# EAGLE design Schematic_RO (EAGLE 9.6.2)
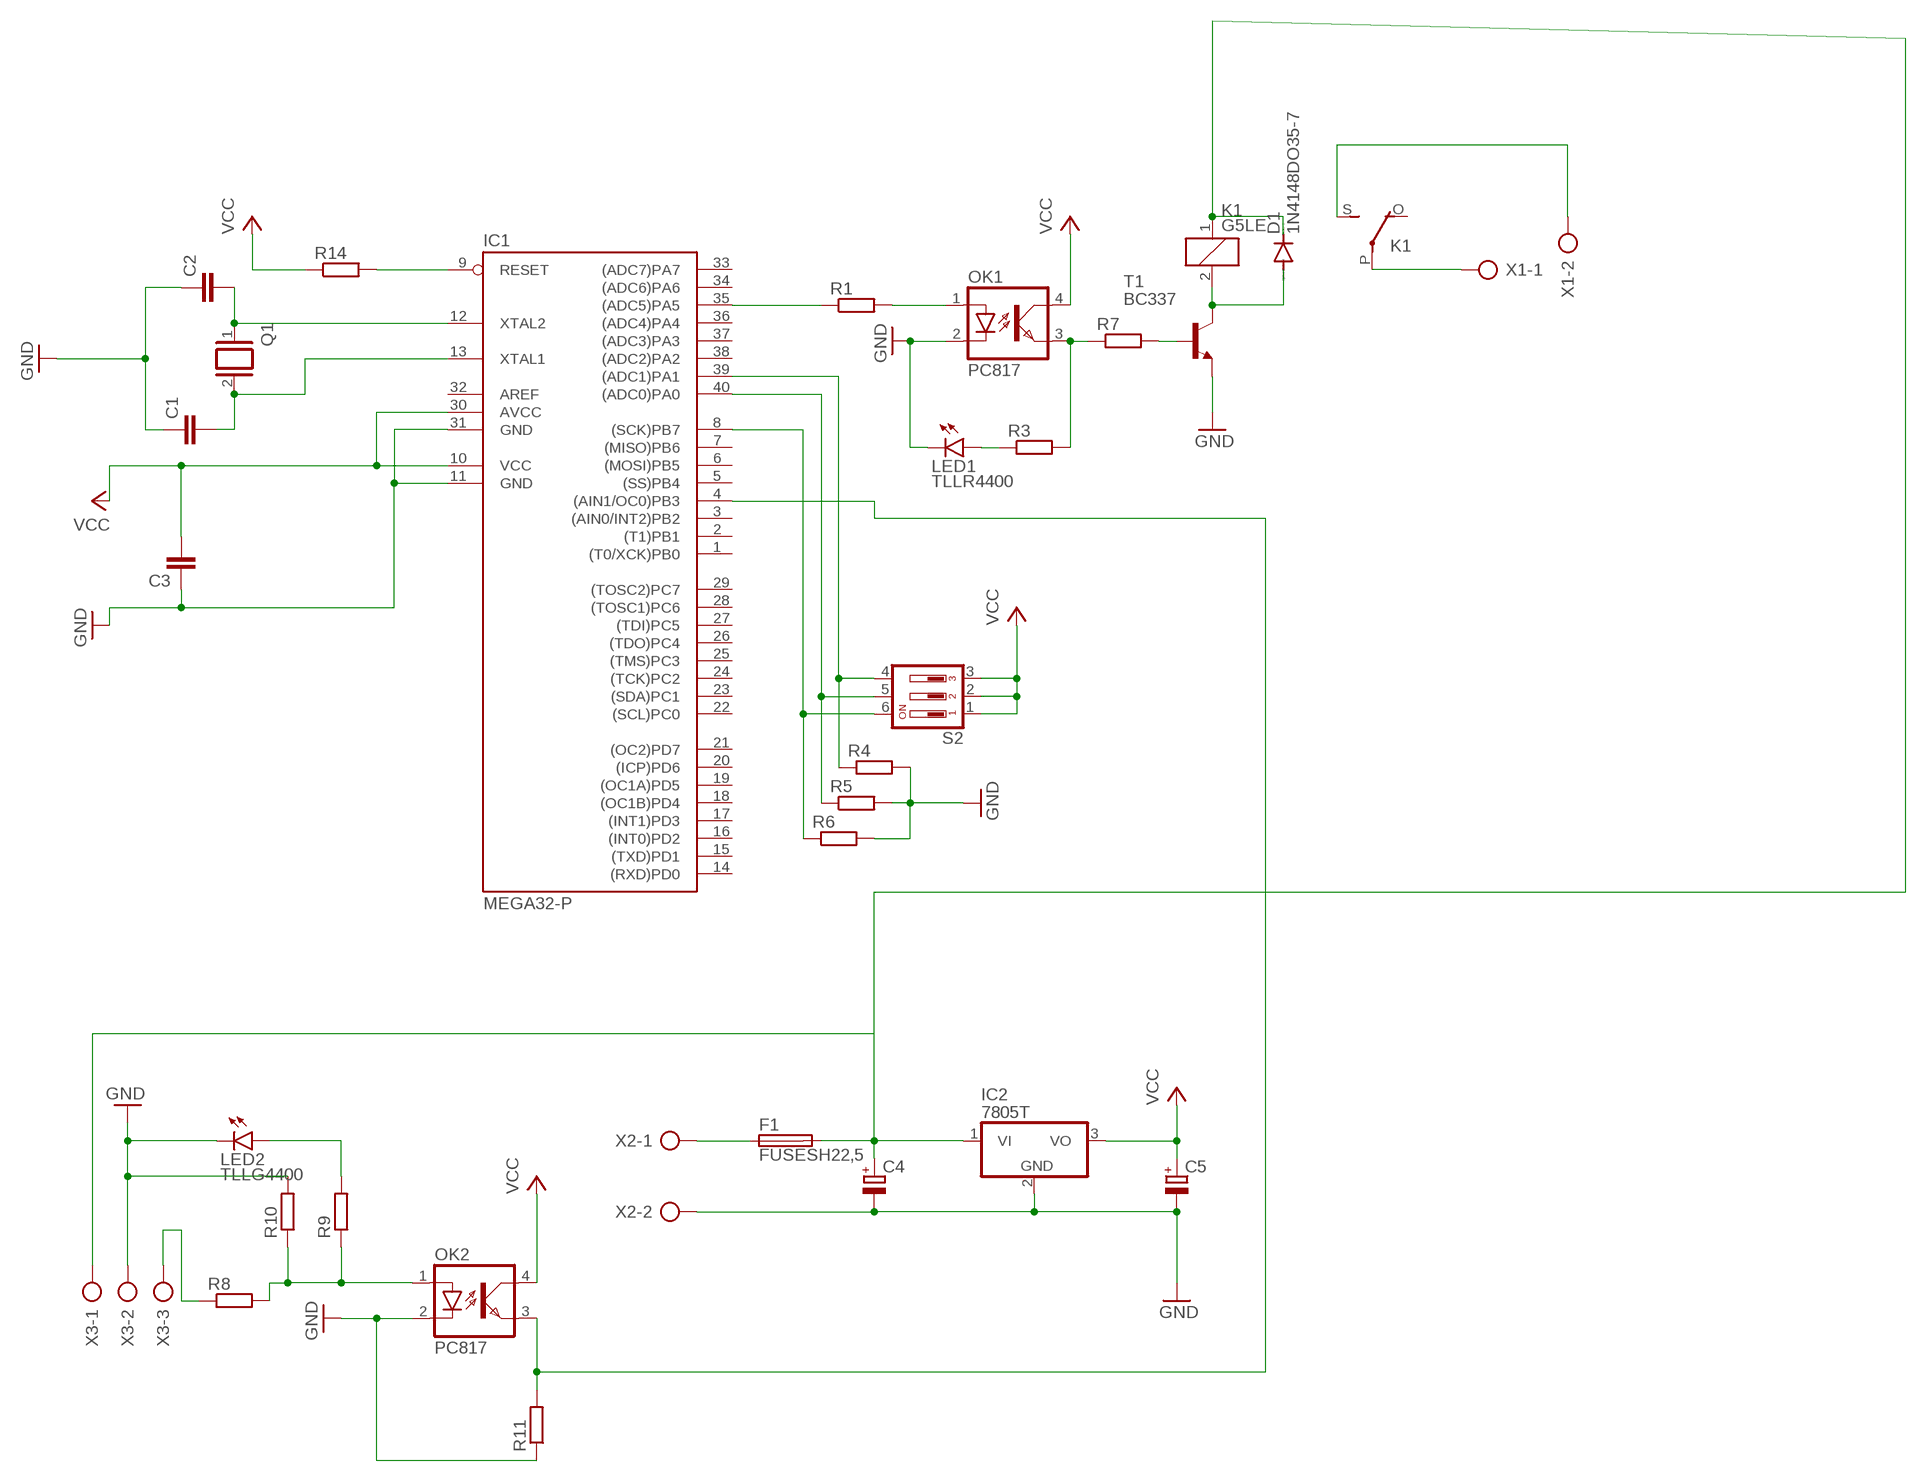
[diagram p0: schematic, sheet 1]

## Parts
C1  C2,5-3  [C2.5-3]
C2  C2,5-3  [C2.5-3]
C3  C2,5-3  [C2.5-3]
C4  CPOL-EUE2,5-6E  [E2,5-6E]
C5  CPOL-EUE2,5-6E  [E2,5-6E]
D1  1N4148DO35-7  [DO35-7]
F1  FUSESH22,5  [SH22,5]
IC1  MEGA32-P  [DIL40]
IC2  7805T  [TO220H]
K1  G5LE  [G5LE]
LED1  TLLR4400  [LED3MM]
LED2  TLLG4400  [LED3MM]
OK1  PC817  [DIL04]
OK2  PC817  [DIL04]
Q1  XTAL/S  [QS]
R1  R-EU_0204/7  [0204/7]
R3  R-EU_0204/7  [0204/7]
R4  R-EU_0204/7  [0204/7]
R5  R-EU_0204/7  [0204/7]
R6  R-EU_0204/7  [0204/7]
R7  R-EU_0204/7  [0204/7]
R8  R-EU_0204/7  [0204/7]
R9  R-EU_0204/7  [0204/7]
R10  R-EU_0204/7  [0204/7]
R11  R-EU_0204/7  [0204/7]
R14  R-EU_0204/7  [0204/7]
S2  DIP03YL  [DIP03YL]
T1  BC337  [TO92]
X1  AK300/2  [AK300/2]
X2  AK300/2  [AK300/2]
X3  AK300/3  [AK300/3]

## Nets
GND: C1.1 C2.1 C3.1 C4.- C5.- IC1.11(GND) IC1.31(GND) IC2.2(GND) LED1.K(C) LED2.K(C) OK1.2(C) OK2.2(C) R4.2 R5.2 R6.2 R10.2 R11.1 T1.1(E) X2.2 X3.2
N$1: C2.2 IC1.12(XTAL2) Q1.1
N$2: C1.2 IC1.13(XTAL1) Q1.2
N$3: IC1.9(RESET) R14.2
N$4: IC1.39((ADC1)PA1) R4.1 S2.4
N$5: IC1.40((ADC0)PA0) R5.1 S2.5
N$6: IC1.8((SCK)PB7) R6.1 S2.6
N$7: IC1.35((ADC5)PA5) R1.1
N$8: OK1.1(A) R1.2
N$9: OK1.3(EMIT) R3.2 R7.1
N$10: R7.2 T1.2(B)
N$11: LED1.A R3.1
N$12: D1.A K1.2 T1.3(C)
N$13: R8.1 X3.3
N$14: K1.P(2:P) X1.1
N$15: K1.S(2:S) X1.2
N$16: F1.1 X2.1
N$17: IC1.4((AIN1/OC0)PB3) OK2.3(EMIT) R11.2
N$18: C4.+ D1.C F1.2 IC2.1(VI) K1.1 X3.1
N$19: OK2.1(A) R8.2 R9.1 R10.1
N$20: LED2.A R9.2
VCC: C3.2 C5.+ IC1.10(VCC) IC1.30(AVCC) IC2.3(VO) OK1.4(COL) OK2.4(COL) R14.1 S2.1 S2.2 S2.3
Unconnected: IC1.1((T0/XCK)PB0) IC1.2((T1)PB1) IC1.3((AIN0/INT2)PB2) IC1.5((SS)PB4) IC1.6((MOSI)PB5) IC1.7((MISO)PB6) IC1.14((RXD)PD0) IC1.15((TXD)PD1) IC1.16((INT0)PD2) IC1.17((INT1)PD3) IC1.18((OC1B)PD4) IC1.19((OC1A)PD5) IC1.20((ICP)PD6) IC1.21((OC2)PD7) IC1.22((SCL)PC0) IC1.23((SDA)PC1) IC1.24((TCK)PC2) IC1.25((TMS)PC3) IC1.26((TDO)PC4) IC1.27((TDI)PC5) IC1.28((TOSC1)PC6) IC1.29((TOSC2)PC7) IC1.32(AREF) IC1.33((ADC7)PA7) IC1.34((ADC6)PA6) IC1.36((ADC4)PA4) IC1.37((ADC3)PA3) IC1.38((ADC2)PA2) K1.O(2:O)

## Library data of the parts
C1-C3 = capacitor-wima:C: CAPACITOR naming: grid - package width
C4 C5 = rcl:CPOL-EU: POLARIZED CAPACITOR, European symbol; SPICEPREFIX: C
D1 = diode:1N4148: DIODE high speed (Philips)
F1 = fuse:FUSE: Fuse; OC_FARNELL: unknown; OC_NEWARK: unknown
IC1 = atmel:MEGA32-P: MICROCONTROLLER 32 Kbytes FLASH 2 Kbytes SRAM 1 Kbytes EEPROM USART 8-channel 10 bit ADC Source: www.atmel.com .. doc2503.pdf; MPN: ATMEGA32-16PU; OC_FARNELL: 1661729; OC_NEWARK: 51P1794
IC2 = linear:78*: Positive VOLTAGE REGULATOR Source: http://cache.national.com/ds/LM/LM78L05.pdf http://www.fairchildsemi.com/ds/LM/LM7805.pdf
K1 = relay:G5LE: RELAY 1 x switch, 10 A/120 V AC, 8 A/30 V DC, Omron; OC_FARNELL: unknown; OC_NEWARK: unknown
LED1 = led:TLLR4400: Low Current (2mA) LED 3 mm Tinted Diffused Package color RED Source: Data sheet <http://www.farnell.com/datasheets/391100.pdf>; MF: VISHAY SEMICONDUCTOR; OC_FARNELL: 1612437
LED2 = led:TLLG4400: Low Current (2mA) LED 3 mm Tinted Diffused Package color GREEN Source: Data sheet <http://www.farnell.com/datasheets/391098.pdf>; MF: VISHAY SEMICONDUCTOR; OC_FARNELL: 1612435
OK1 OK2 = optocoupler:PC817: SHARP OPTO COUPLER; MPN: PC817X4J000F; OC_FARNELL: 9707727; OC_NEWARK: 97K7059
Q1 = special:XTAL/S: CRYSTAL
R1 R3-R11 R14 = rcl:R-EU_: RESISTOR, European symbol; SPICEPREFIX: R
S2 = switch-dil:DIP03YL: DIL/CODE SWITCH; OC_FARNELL: unknown; OC_NEWARK: unknown
T1 = transistor:BC337: NPN TRANSISTOR
X1 X2 = con-ptr500:AK300/2: CONNECTOR; OC_FARNELL: unknown; OC_NEWARK: unknown
X3 = con-ptr500:AK300/3: CONNECTOR; OC_FARNELL: unknown; OC_NEWARK: unknown

## Board
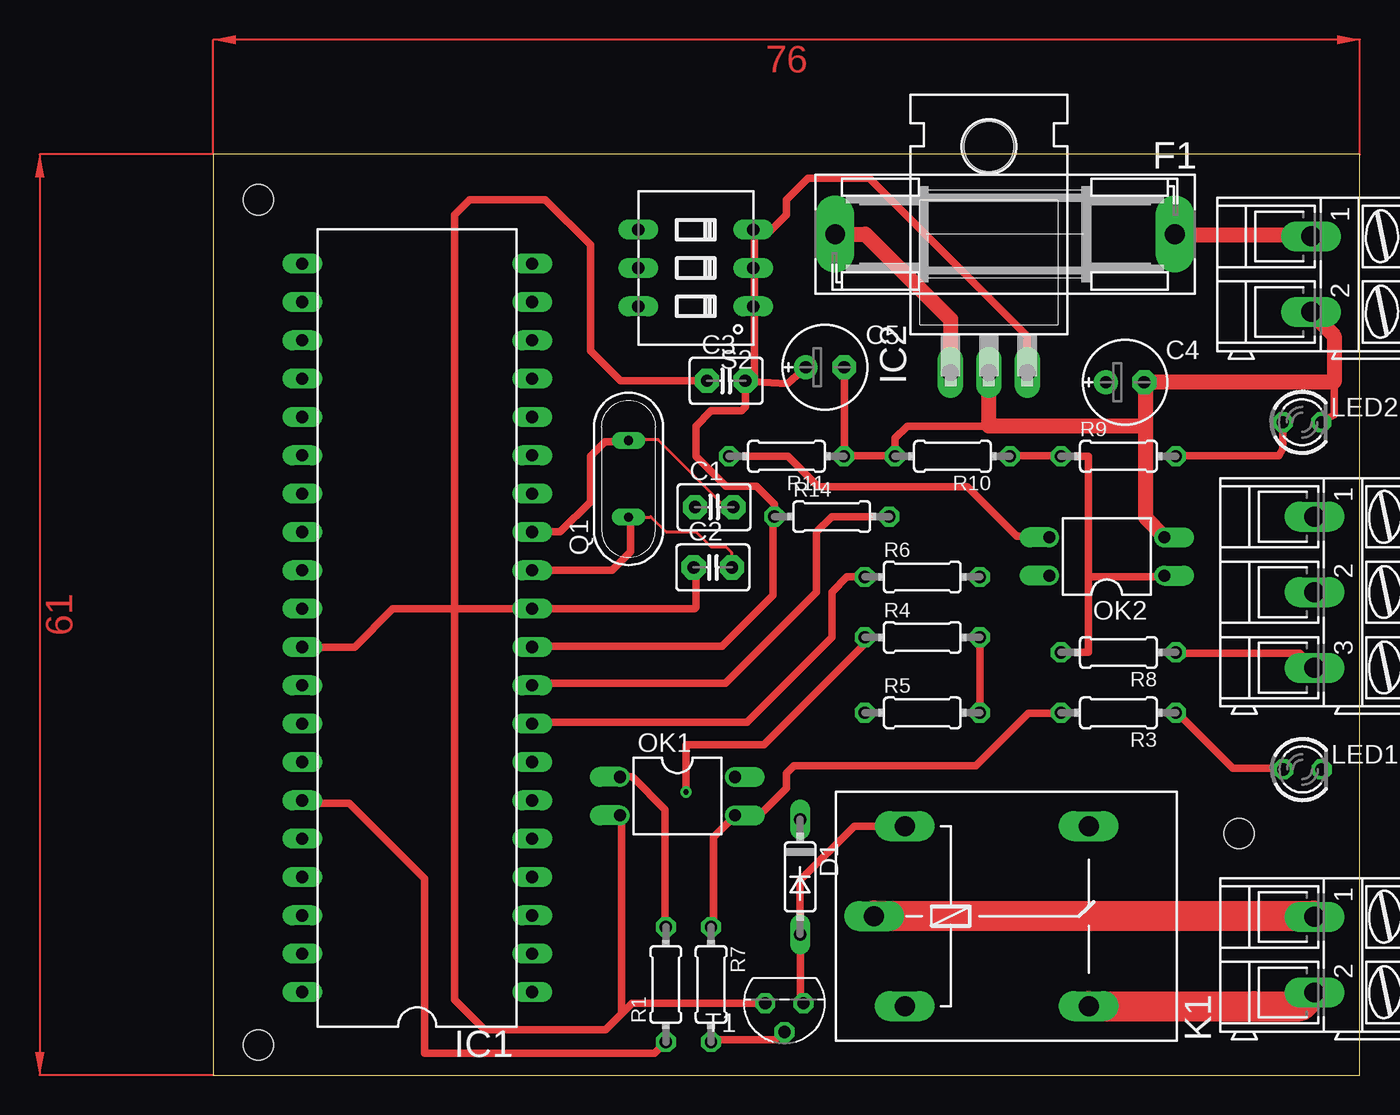
[diagram p1: board, top side]
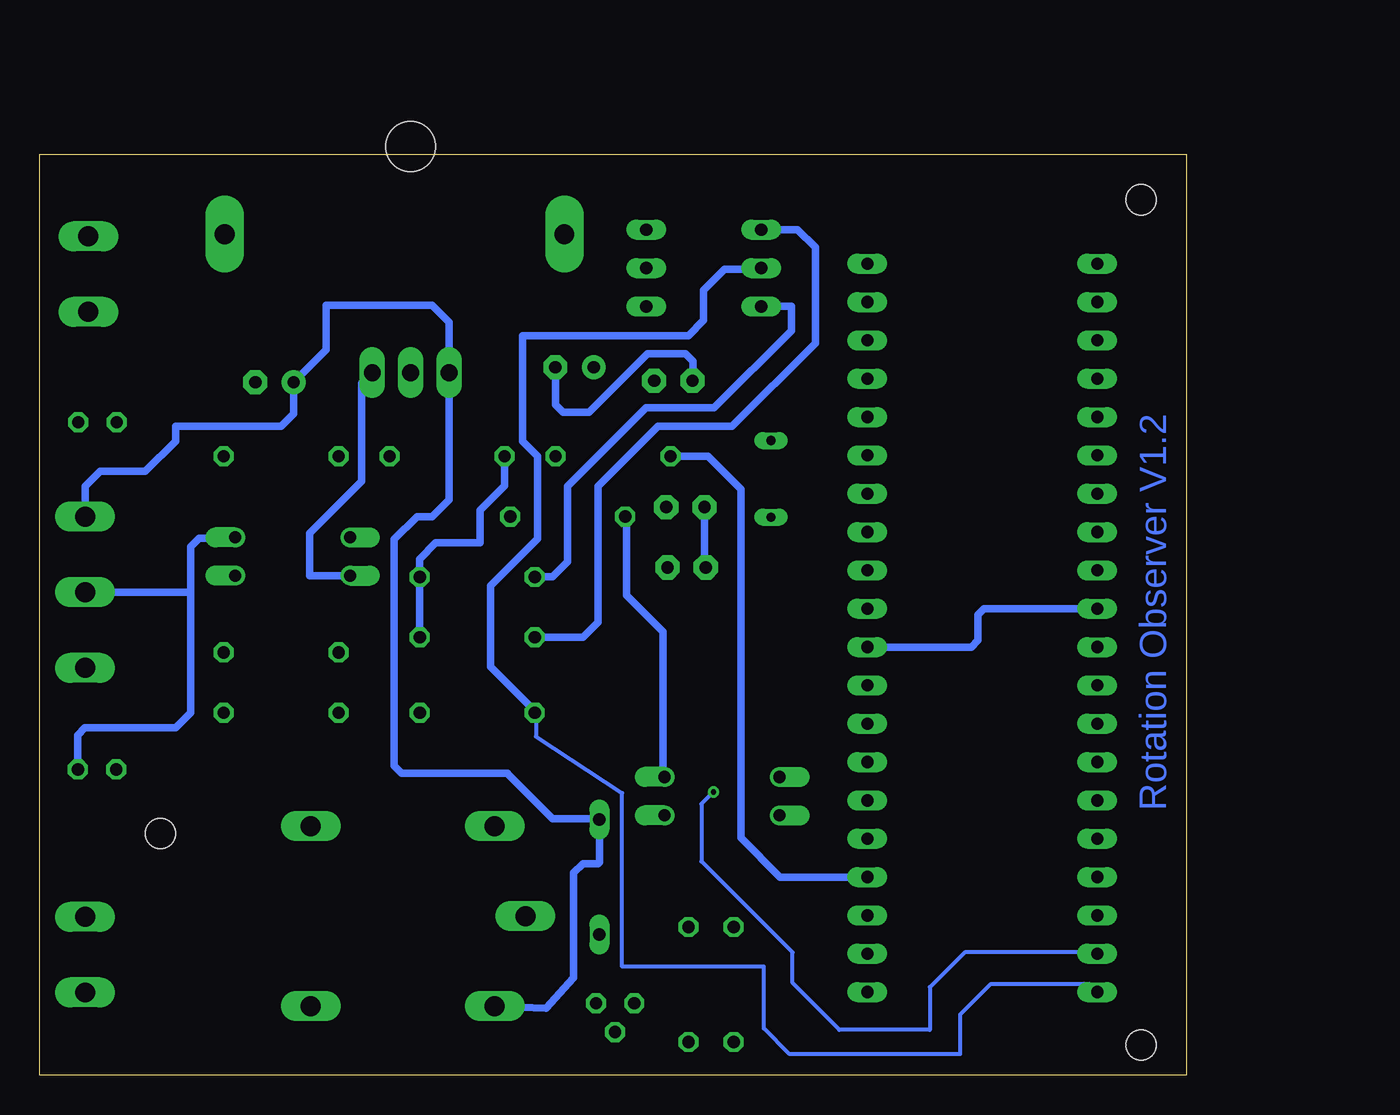
[diagram p2: board, bottom side, seen from below]

Size 76 x 61 mm. Coordinates in mm from the lower left corner, seen from the top.
Outline: 0,0 76,0 76,61 0,61 0,0
Copper layers (1*16): Top 0.035mm / dielectric 1.5mm / Bottom 0.035mm
Design rules "default": minimum track width 6mil, minimum drill 0.35mm, track to track 6mil, track to pad 6mil, pad to pad 6mil, via to via 6mil, smd to smd 6mil, copper to edge 40mil, drill to drill 6mil, minimum pad ring 10mil, minimum via ring 8mil, stop-mask expansion 4mil, vias tented up to drill 0mil, thermal gap 10mil
Holes 2 mm at 3,58 3,2 68,16

### Footprints (pad centres in the part's own frame; a part is rotated, then mirrored left to right if it is on the bottom)
C2.5-3 = drill 0.813 pad 1.6 octagon: 1 -1.27,0; 2 1.27,0
E2,5-6E = drill 0.813 pad 1.575: + -1.27,0 | drill 0.813 pad 1.575 octagon: - 1.27,0
DO35-7 = drill 0.813 long: A 3.81,0; C -3.81,0
SH22,5 = drill 1.321 pad 2.54 long: 1 -11.252,0; 2 11.252,0
DIL40 = drill 0.813 long: 1 -24.13,-7.62; 2 -21.59,-7.62; 3 -19.05,-7.62; 4 -16.51,-7.62; 5 -13.97,-7.62; 6 -11.43,-7.62; 7 -8.89,-7.62; 8 -6.35,-7.62; 9 -3.81,-7.62; 10 -1.27,-7.62; 11 1.27,-7.62; 12 3.81,-7.62; 13 6.35,-7.62; 14 8.89,-7.62; 15 11.43,-7.62; 16 13.97,-7.62; 17 16.51,-7.62; 18 19.05,-7.62; 19 21.59,-7.62; 20 24.13,-7.62; 21 24.13,7.62; 22 21.59,7.62; 23 19.05,7.62; 24 16.51,7.62; 25 13.97,7.62; 26 11.43,7.62; 27 8.89,7.62; 28 6.35,7.62; 29 3.81,7.62; 30 1.27,7.62; 31 -1.27,7.62; 32 -3.81,7.62; 33 -6.35,7.62; 34 -8.89,7.62; 35 -11.43,7.62; 36 -13.97,7.62; 37 -16.51,7.62; 38 -19.05,7.62; 39 -21.59,7.62; 40 -24.13,7.62
TO220H = drill 1.118 long: 1 -2.54,-10.16; 2 0,-10.16; 3 2.54,-10.16 | hole 3.302: 0,4.826
G5LE = drill 1.321 long: 1 -7.493,-5.969; 2 -7.493,5.969; O 4.699,5.969; P -9.525,0; S 4.699,-5.969
LED3MM = drill 0.813 octagon: A -1.27,0; K 1.27,0
DIL04 = drill 0.813 offset: 1 -1.27,-3.81; 2 1.27,-3.81; 3 1.27,3.81; 4 -1.27,3.81
QS = drill 0.61 long: 1 -2.54,0; 2 2.54,0
0204/7 = drill 0.813 octagon: 1 -3.81,0; 2 3.81,0
DIP03YL = drill 0.813 long: 1 -2.54,-3.81; 2 0,-3.81; 3 2.54,-3.81; 4 2.54,3.81; 5 0,3.81; 6 -2.54,3.81
TO92 = drill 0.813 octagon: 1 1.27,0; 2 0,1.905; 3 -1.27,0
AK300/2 = drill 1.321 long: 1 -2.515,0; 2 2.489,0
AK300/3 = drill 1.321 long: 1 -5.004,0; 2 0,0; 3 5.004,0

### Placement (x,y rotation side)
C1  33.2,37.63 0 top
C2  33.12,33.63 0 top
C3  34,46 0 top
C4  60.44,45.9 0 top
C5  40.55,46.9 0 top
D1  38.9,13.13 270 top
F1  52.48,55.72 180 top
IC1  13.52,29.63 90 top
IC2  51.41,56.7 0 top
K1  53.33,10.53 0 top
LED1  72.2,20.25 0 top
LED2  72.17,43.25 0 top
OK1  30.77,18.48 270 top
OK2  59.23,34.36 90 top
Q1  27.53,39.5 90 top
R1  30,6 90 top
R3  60,24 180 top
R4  47,29 0 top
R5  47,24 0 top
R6  47,33 0 top
R7  33,6 270 top
R8  60,28 180 top
R9  60,41 0 top
R10  49,41 180 top
R11  38,41 180 top
R14  41,37 0 top
S2  31.99,53.47 90 top
T1  37.86,4.75 180 top
X1  72.99,7.96 270 top
X2  72.77,53.05 270 top
X3  72.99,31.99 270 top

### Tracks (layer width: path | path; a pad name or v marks a point on that pad's centre or on a via)
GND
  Top 0.152: 21.11,30.84 IC1.11 21.26,30.99 | 36.5,4.77 T1.1 | 72.77,50.49 X2.2 | 61.8,45.77 C4.- | 63.02,35.71 OK2.2 | 61.8,45.92 C4.- | 50.83,24.13 R5.2 | 50.83,28.85 R4.2 | 45.19,41.05 R10.2 45.34,41.05 | 41.84,46.77 C5.- | 41.84,41.05 R11.1 | 32.69,45.92 C3.1 | 61.81,43 61.71,43.1 C4.- | OK1.2 27.05,17.12 | C2.1 32,33.48 | 32,31 31.9,30.9
  Top 0.5: 74.3,45.92 74.3,43.74 LED2.K | 50.83,28.85 50.83,24.13 | 45.19,41.05 41.84,41.05 41.84,46.77 | IC1.31 9.36,28.36 11.9,30.9 16,30.9 | 16,30.9 IC1.11 31.9,30.9 | 27.05,4.05 26,3 18,3 16,5 16,30.9 | C3.1 27,46 25,48 25,55 22,58 17,58 16,57 16,30.9 | R10.2 45.19,42.19 46,43 51.41,43 | T1.1 27.75,4.75 27.05,4.05 | 27.05,17.12 27.05,4.05 | 32,33.48 32,31
  Top 1: 72.77,50.49 74.3,48.97 74.3,45.92 61.8,45.92 | 61.8,43 61.8,36.93 63.02,35.71 | 61.8,43 61.8,45.77 | 61.8,43 51.41,43 IC2.2
  Bottom 0.152: 31.93,33.73 C2.1 | 31.93,37.54 C1.1 | 72.93,31.9 X3.2 | 63.17,35.56 OK2.2 | 66.01,31.99 66,32 | 32.7,46.03 C3.1
  Bottom 0.5: 31.93,37.54 31.93,33.73 | R10.2 45.19,39.05 46.8,37.44 46.8,35.25 49.75,35.25 50.81,34.19 R6.2 R4.2 | 63.17,35.56 65.44,35.56 66,35 66,32 66,24 67,23 73,23 73.47,22.53 LED1.K | X3.2 66.01,31.99 | C5.- 41.82,44.42 41.3,43.9 39.6,43.9 35.7,47.8 33.2,47.8 32.7,47.3 32.7,46.03
N$1
  Top 0.152: 27.51,36.93 Q1.1 27.66,36.93 | 28.96,36.96 29,37
  Top 0.2: C2.2 34.37,33.73 34.37,34.63 34,35 33,35 32,36 30,36 29,37 | Q1.1 28.96,36.96
  Top 0.5: IC1.12 26.44,33.44 27.66,34.66 27.66,36.93
N$2
  Top 0.152: 27.66,41.96 Q1.2 27.51,41.96 | IC1.13 21.16,36
  Top 0.2: C1.2 33.97,37.63 29.5,42.1 27.8,42.1 27.66,41.96
  Top 0.5: 21.16,36 23,36 25,38 25,41 25.96,41.96 27.51,41.96
N$3
  Top 0.152: IC1.9 21.26,25.96
  Top 0.5: R14.2 41,37 40,36 40,32 33.96,25.96 21.26,25.96
N$4  (via drill 0.35)
  Top 0.152: 43.19,28.59 R4.1 | 31.34,21.84 31.4,21.9
  Top 0.5: v31.34,18.76 31.34,21.84 | 31.4,21.9 36.5,21.9 43.19,28.59
  Bottom 0.152: 6.02,8.13 IC1.39 | 43.06,28.85 R4.1 43.06,29.01 | 31.37,18.8 v31.34,18.76
  Bottom 0.25: 6.02,8.13 14.69,8.13 17,5.82 17,3 23,3 26.1,6.1 26.1,8.13 32.14,14.16 32.14,17.96 v31.34,18.76
  Bottom 0.5: S2.4 25.76,56.01 24.6,54.85 24.6,48.5 30.1,43 35,43 39,39 39,30 40,29 R4.1
N$5
  Bottom 0.152: 28.27,53.39 S2.5 | 43.21,24.13 R5.1 | 35.73,48.99 35.72,49
  Bottom 0.25: 6.02,5.54 IC1.40 6.4,6 13,6 15,4 15,1.39 26.3,1.39 28,3.09 28,7.19 37.4,7.19 37.4,18.67 43.1,22.42 43.1,23.91 R5.1
  Bottom 0.5: 28.27,53.39 30.61,53.39 32,52 32,50 33,49 35.72,49 | 35.73,48.99 44,48.99 44,42 43,41 43,35.55 46.12,32.43 46.12,27.04 43.21,24.13
N$6
  Top 0.152: 21.26,23.37 IC1.8
  Top 0.5: 21.26,23.37 35.37,23.37 41,29 41,32 42,33 R6.1
  Bottom 0.152: 28.27,50.8 S2.6
  Bottom 0.5: S2.6 26.18,50.93 26.18,49.32 31.3,44.2 35.8,44.2 41,39 41,34 42,33 R6.1
N$7
  Top 0.152: IC1.35 6.1,18
  Top 0.5: R1.1 29.25,1.44 14,1.44 14,13 9,18 6.1,18
N$8
  Top 0.152: 29.95,9.96 R1.2
  Top 0.5: OK1.1 27.79,19.75 29.95,17.59 29.95,9.96
N$9
  Top 0.152: 33.15,9.96 R7.1 | 34.52,17.12 OK1.3 | 56.16,23.98 R3.2
  Top 0.5: 33.15,9.96 33.15,15.75 34.52,17.12 | 56.16,23.98 54.05,23.98 50.56,20.49 38.89,20.49 38.49,20.49 38,20 38,19 36.21,17.21 OK1.3
N$10
  Top 0.152: 37.27,2.34 37.72,2.79 T1.2 | 33.15,2.34 R7.2
  Top 0.5: 37.27,2.34 33.15,2.34
N$11
  Top 0.152: 70.86,20.32 LED1.A | 63.94,23.98 R3.1
  Top 0.5: 70.86,20.32 67.59,20.32 63.94,23.98
N$12
  Top 0.152: 38.94,4.93 39.09,4.77 T1.3 | 38.94,9.19 D1.A 38.79,9.35 | 45.8,16.36 K1.2
  Top 0.5: 38.94,4.93 38.94,9.19 | K1.2 42.5,16.5 38.9,12.9 D1.A
N$13
  Top 0.152: 63.94,27.94 R8.1 | 72.93,27.02 X3.3
  Top 0.5: 63.94,27.94 72.01,27.94 72.93,27.02
N$14
  Top 0.152: 72.93,10.57 X1.1 | 43.82,10.57 K1.P
  Top 2: 43.82,10.57 72.93,10.57
N$15
  Top 2: K1.S 69,4.56 72.08,4.56 X1.2
N$16
  Top 0.152: 72.62,55.68 X2.1 | 63.78,55.68 F1.1
  Top 1: 63.78,55.68 72.62,55.68
N$17
  Top 0.152: 55.4,35.71 OK2.3
  Top 0.5: 55.4,35.71 53.27,35.71 50,38.98 40.13,38.98 38.11,41 R11.2
  Bottom 0.5: R11.2 31.7,41 29.52,38.82 29.52,15.72 26.92,13.12 IC1.4
N$18
  Top 0.152: F1.2 41.38,55.68 | C4.+ 58.9,45.9
  Top 1: F1.2 43.23,55.72 48.87,50.08 IC2.1
  Bottom 0.152: 38.94,16.81 D1.C 38.94,16.97 | 45.8,4.62 K1.1 | 42.08,16.97 42,16.97 | 45,19.97 45,20 | 39,14 38.9,14.1
  Bottom 0.5: 38.94,16.97 42,16.97 45,19.97 | X3.1 72.99,39.01 72,40 69,40 67,42 67,43 60,43 59.17,43.83 C4.+ 57,48.07 57,51 50,51 48.87,49.87 IC2.1 48.87,38.13 50,37 51,37 52.5,35.5 52.5,20.5 52,20 45,20 | K1.1 42.44,4.44 40.6,6.43 40.6,13.4 40,14 39,14 | 38.9,14.1 D1.C
N$19
  Top 0.152: 52.96,41.05 R10.1 | 56.16,41.05 R9.1 56.31,40.89 | OK2.1 62.95,33
  Top 0.5: 56.16,41.05 52.96,41.05 | R8.2 58,28 58,33 | R9.1 58,41 58,33 | 62.95,33 58,33
N$20
  Top 0.152: 63.94,41.05 R9.2
  Top 0.5: 63.94,41.05 70.64,41.05 70.9,41.5 LED2.A
VCC
  Top 0.152: 21.26,28.4 IC1.10 | 37.11,36.93 R14.1 37.11,37.08 | 35.89,50.95 S2.1 35.89,50.8 | 35.89,53.39 S2.2 35.89,53.54 | 35.89,55.98 S2.3 | C3.2 35.28,45.92 35.89,45.92 C3.2 | 39.4,46.92 C5.+ | 35.13,45.92 C3.2 | 54,46.59 IC2.3
  Top 0.5: 21.26,28.4 33.71,28.4 37.11,31.8 37.11,36.93 | 35.89,53.39 35.89,50.95 | 35.89,53.54 35.89,55.98 36.98,55.98 38,57 38,58 39.41,59.41 43.5,59.41 53.95,48.96 IC2.3 | C5.+ 38.08,45.8 35.89,45.92 35.89,50.8 | R14.1 37.19,37.81 36,39 34,39 32,41 32,43 33,44 35,44 35.28,44.28 35.28,45.92
  Bottom 0.152: 34.67,19.86 OK1.4 | 37.11,36.93 R14.1 | IC1.30 6,31
  Bottom 0.5: 34.67,19.86 34.67,29.36 37.11,31.8 37.11,36.93 | OK2.4 58.1,33.09 58.1,35.9 54.65,39.35 54.65,45.84 IC2.3 | IC1.30 13.4,30.9 13.8,30.5 13.8,28.8 14.24,28.36 IC1.10
(copper drawn outside any net)
  shapes: Top area x2

### Text on the board
Bottom: Rotation Observer V1.2